# EAGLE board yoocnc_grbl (EAGLE 6.5.0)
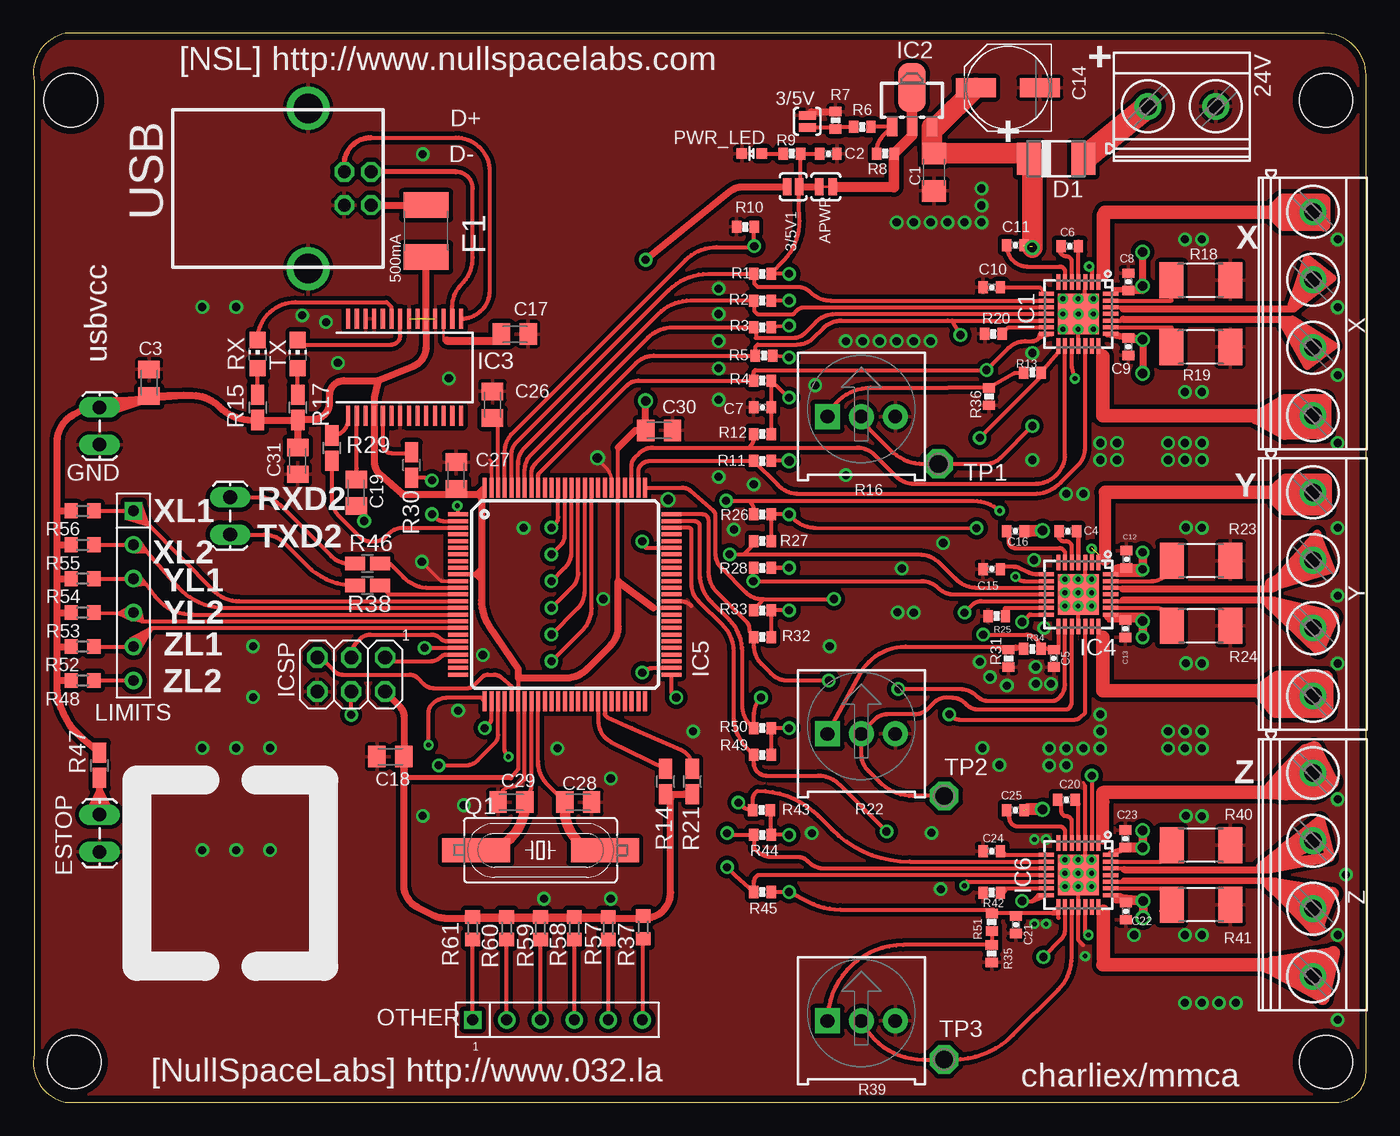
[diagram p6: board, top side]
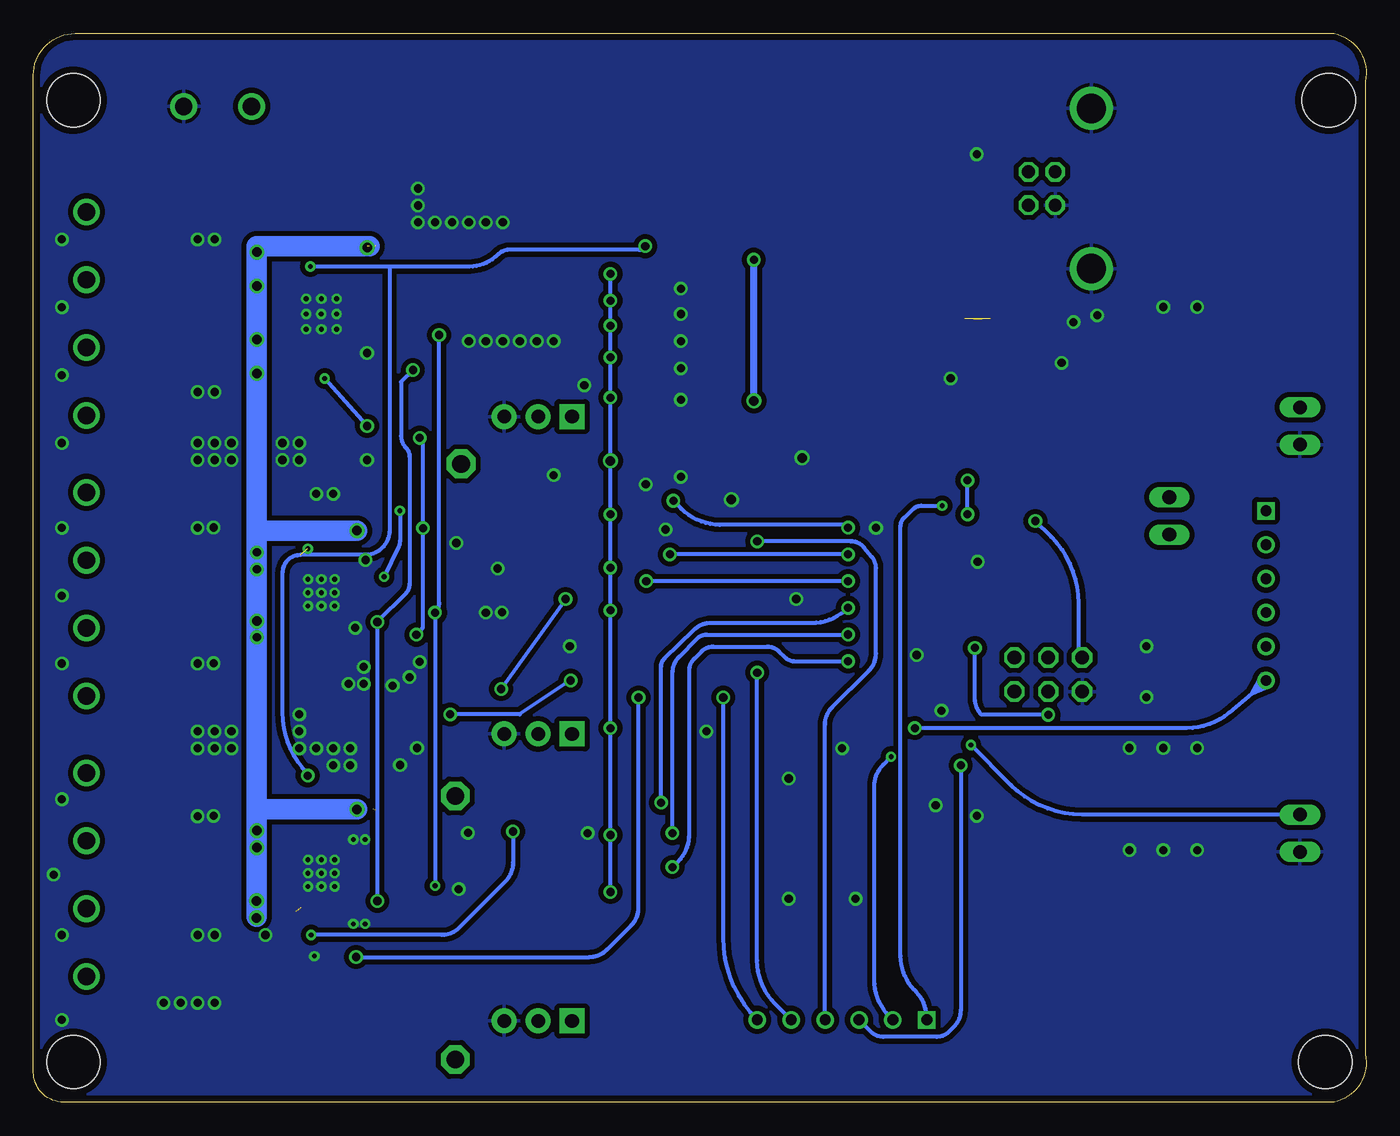
[diagram p7: board, bottom side, seen from below]

Size 99.8 x 80 mm. Coordinates in mm from the lower left corner, seen from the top.
Outline: 2.38,80 arc90 0.07,76.41 0.07,3.59 arc90 2.39,0 97.54,0 arc90 99.8,2.25 99.8,76.86 arc90 96.66,80 2.38,80
Copper layers (1*16): Top 0.0356mm / dielectric 1.5011mm / Bottom 0.0356mm
Design rules "SilverCircuits": minimum track width 7mil, minimum drill 14mil, track to track 7mil, track to pad 7mil, pad to pad 7mil, via to via 7mil, smd to smd 0mil, copper to edge 20mil, drill to drill 8mil, minimum pad ring 10mil, minimum via ring 8mil, stop-mask expansion 4mil, vias tented up to drill 0mil, thermal gap 10mil
Net classes: 0 default: width 0.305 mm, drill 0.305 mm, clearance 0.152 mm; 1 power: width 0.152 mm, drill 0.305 mm, clearance 0.152 mm; 2 gnd: width 0.152 mm, drill 0.305 mm, clearance 0.152 mm; 3 usbvcc: width 0.508 mm, drill 0.305 mm, clearance 0.152 mm
Holes 4 mm at 2.8,75 3.07,3 96.8,3 96.8,75

## Footprints (pad centres in the part's own frame; a part is rotated, then mirrored left to right if it is on the bottom)
SJ_2S-NO = smd 0.635 x 1.27: 1 -0.45,0; 2 0.45,0
MKDSN1,5/2-5,08 = drill 1.3 pad 2: 1 -2.561,0.025; 2 2.519,0.025
SJ_2S-TRACE = smd 0.635 x 1.27: 1 -0.508,0; 2 0.508,0
1206 = smd 1.6 x 1.8: 1 -1.4,0; 2 1.4,0
0402-CAP = smd 0.7 x 0.9: 1 -0.65,0; 2 0.65,0
C0805K = smd 1.3 x 1.6: 1 -1,0; 2 1,0
PANASONIC_D = smd 3 x 1.4: + 2.4,0; - -2.4,0
DO-214AC = smd 1.8 x 2.4: A 2.025,0; C -2.025,0
1X02_LOCK_LONGPADS = drill 1.016 long: 1 -0.127,0; 2 2.667,0
L1812 = smd 1.9 x 3.4: 1 -1.95,0; 2 1.95,0
QFN-28-5MM = smd 1.15 x 0.3: P$1 -2.4,1.5; P$2 -2.4,1; P$3 -2.4,0.5; P$4 -2.4,0; P$5 -2.4,-0.5; P$6 -2.4,-1; P$7 -2.4,-1.5; P$15 2.4,-1.5; P$16 2.4,-1; P$17 2.4,-0.5; P$18 2.4,0; P$19 2.4,0.5; P$20 2.4,1; P$21 2.4,1.5 | smd 0.3 x 1.15: P$8 -1.5,-2.4; P$9 -1,-2.4; P$10 -0.5,-2.4; P$11 0,-2.4; P$12 0.5,-2.4; P$13 1,-2.4; P$14 1.5,-2.4; P$22 1.5,2.4; P$23 1,2.4; P$24 0.5,2.4; P$25 0,2.4; P$26 -0.5,2.4; P$27 -1,2.4; P$28 -1.5,2.4 | smd 3.048 x 3.048: P$29 0,0
SCHMALZHAUS_SOT89 = smd 0.8 x 1.4: ADJ -1.499,-1.981; IN 1.499,-1.981; OUT 0,-1.98 | smd 2.032 x 3.65: OUT@1 0,0.94
SSOP28 = smd 0.381 x 1.499: 1 -4.225,-3.625; 2 -3.575,-3.625; 3 -2.925,-3.625; 4 -2.275,-3.625; 5 -1.625,-3.625; 6 -0.975,-3.625; 7 -0.325,-3.625; 8 0.325,-3.625; 9 0.975,-3.625; 10 1.625,-3.625; 11 2.275,-3.625; 12 2.925,-3.625; 13 3.575,-3.625; 14 4.225,-3.625; 15 4.225,3.625; 16 3.575,3.625; 17 2.925,3.625; 18 2.275,3.625; 19 1.625,3.625; 20 0.975,3.625; 21 0.325,3.625; 22 -0.325,3.625; 23 -0.975,3.625; 24 -1.625,3.625; 25 -2.275,3.625; 26 -2.925,3.625; 27 -3.575,3.625; 28 -4.225,3.625
TQFP100 = smd 1.5 x 0.3: 1 -8,6; 2 -8,5.5; 3 -8,5; 4 -8,4.5; 5 -8,4; 6 -8,3.5; 7 -8,3; 8 -8,2.5; 9 -8,2; 10 -8,1.5; 11 -8,1; 12 -8,0.5; 13 -8,0; 14 -8,-0.5; 15 -8,-1; 16 -8,-1.5; 17 -8,-2; 18 -8,-2.5; 19 -8,-3; 20 -8,-3.5; 21 -8,-4; 22 -8,-4.5; 23 -8,-5; 24 -8,-5.5; 25 -8,-6; 51 8,-6; 52 8,-5.5; 53 8,-5; 54 8,-4.5; 55 8,-4; 56 8,-3.5; 57 8,-3; 58 8,-2.5; 59 8,-2; 60 8,-1.5; 61 8,-1; 62 8,-0.5; 63 8,0; 64 8,0.5; 65 8,1; 66 8,1.5; 67 8,2; 68 8,2.5; 69 8,3; 70 8,3.5; 71 8,4; 72 8,4.5; 73 8,5; 74 8,5.5; 75 8,6 | smd 0.3 x 1.5: 26 -6,-8; 27 -5.5,-8; 28 -5,-8; 29 -4.5,-8; 30 -4,-8; 31 -3.5,-8; 32 -3,-8; 33 -2.5,-8; 34 -2,-8; 35 -1.5,-8; 36 -1,-8; 37 -0.5,-8; 38 0,-8; 39 0.5,-8; 40 1,-8; 41 1.5,-8; 42 2,-8; 43 2.5,-8; 44 3,-8; 45 3.5,-8; 46 4,-8; 47 4.5,-8; 48 5,-8; 49 5.5,-8; 50 6,-8; 76 6,8; 77 5.5,8; 78 5,8; 79 4.5,8; 80 4,8; 81 3.5,8; 82 3,8; 83 2.5,8; 84 2,8; 85 1.5,8; 86 1,8; 87 0.5,8; 88 0,8; 89 -0.5,8; 90 -1,8; 91 -1.5,8; 92 -2,8; 93 -2.5,8; 94 -3,8; 95 -3.5,8; 96 -4,8; 97 -4.5,8; 98 -5,8; 99 -5.5,8; 100 -6,8
2X03 = drill 1.016 octagon: 1 -2.54,-1.27; 2 -2.54,1.27; 3 0,-1.27; 4 0,1.27; 5 2.54,-1.27; 6 2.54,1.27
M1X6 = drill 0.8 square: 1 0,0 | drill 0.8: 2 2.54,0; 3 5.08,0; 4 7.62,0; 5 10.16,0; 6 12.7,0
LED-0603 = smd 0.8 x 0.8: A 0,-0.75; C 0,0.75
SM49 = smd 5.08 x 1.778: 1 -4.826,0; 2 4.826,0
0402-RES = smd 0.7 x 0.9: 1 -0.65,0; 2 0.65,0
R0805W = smd 1.5 x 1: 1 -0.94,0; 2 0.94,0
3386U = drill 1.016 pad 1.88 square: 1 -2.54,-0.015 | drill 1.016 pad 1.88: 2 0,-0.015; 3 2.54,-0.015
R2010 = smd 1.8 x 2.7: 1 -2.2,0; 2 2.2,0
R0603 = smd 1 x 1.1: 1 -0.85,0; 2 0.85,0
CHIP-LED0805 = smd 1.2 x 1.2: A 0,-1.05; C 0,1.05
P1-13 = drill 1.321 pad 2.159 octagon: TP 0,0
PN61729 = drill 0.95 octagon: 1 1.25,4.71; 2 -1.25,4.71; 3 -1.25,2.71; 4 1.25,2.71 | drill 2.2: P$1 -6,0; P$2 6,0
MKDSN1,5/4-5,08 = drill 1.3 pad 2: 1 -7.641,0.025; 2 -2.561,0.025; 3 2.519,0.025; 4 7.599,0.025

## Placement (x,y rotation side)
3/5V  SOLDERJUMPERNO  [SJ_2S-NO]  57.95,73.42 90 top
3/5V1  SOLDERJUMPERNO  [SJ_2S-NO]  56.9,68.52 0 top
24V  24vb  [MKDSN1,5/2-5,08]  86.02,74.51 0 top
APWR  SOLDERJUMPERTRACE  [SJ_2S-TRACE]  59.34,68.51 180 top
C1  .1uF  [1206]  67.44,69.61 270 top
C2  1uF  [0402-CAP]  59.53,71 0 top
C3  100n  [C0805K]  8.66,53.85 90 top
C4  .1uF  [0402-CAP]  77.47,42.74 180 top
C5  .1uf  [0402-CAP]  76.4,33.21 270 top
C6  .1uf  [0402-CAP]  77.6,64.07 180 top
C7  .1uf  [0402-CAP]  54.59,52 180 top
C8  .1uf  [0402-CAP]  81.99,61.4 90 top
C9  .1uf  [0402-CAP]  82,56.54 270 top
C10  .22uF  [0402-CAP]  71.76,60.99 180 top
C11  .1uf  [0402-CAP]  73.53,64.15 0 top
C12  .1uf  [0402-CAP]  81.86,40.64 90 top
C13  .1uf  [0402-CAP]  81.76,35.44 270 top
C14  47uF  [PANASONIC_D]  72.97,75.94 180 top
C15  .22uF  [0402-CAP]  71.76,39.9 180 top
C16  .1uf  [0402-CAP]  73.53,42.75 0 top
C17  100n  [C0805K]  36.05,57.49 180 top
C18  100n  [C0805K]  26.73,25.87 180 top
C19  100n  [C0805K]  24.18,45.62 270 top
C20  .1uf  [0402-CAP]  77.34,22.64 180 top
C21  .1uf  [0402-CAP]  73.57,13.27 270 top
C22  .1uf  [0402-CAP]  81.8,14.31 270 top
C23  .1uf  [0402-CAP]  81.76,19.71 90 top
C24  .22uF  [0402-CAP]  71.76,18.79 180 top
C25  .1uf  [0402-CAP]  73.53,21.86 0 top
C26  100n  [C0805K]  34.37,52.21 90 top
C27  100n  [C0805K]  31.66,46.91 90 top
C28  22p  [C0805K]  40.8,22.46 180 top
C29  22p  [C0805K]  35.8,22.46 0 top
C30  100n  [C0805K]  46.86,50.29 0 top
C31  100n  [C0805K]  19.8,48 270 top
D1  B340A-13-F  [DO-214AC]  76.58,70.62 0 top
ESTOP  [1X02_LOCK_LONGPADS]  4.95,18.86 90 top
F1  500mA  [L1812]  29.4,65.2 90 top
GND  [1X02_LOCK_LONGPADS]  4.95,51.88 270 top
IC1  A4983  [QFN-28-5MM]  78.26,59 270 top
IC2  LM317L  [SCHMALZHAUS_SOT89]  65.8,75 0 top
IC3  FT232RL  [SSOP28]  27.8,55 0 top
IC4  A4983  [QFN-28-5MM]  78.26,38 270 top
IC5  ATMEGA2560AU  [TQFP100]  39.8,38 0 top
IC6  A4983  [QFN-28-5MM]  78.26,17 270 top
ICSP  ICSP  [2X03]  23.8,32 180 top
LIMITS  CON_HEADER_1X06-PTH  [M1X6]  7.49,44.26 270 top
OTHER  CON_HEADER_1X06-PTH  [M1X6]  32.89,6.16 0 top
PWR_LED  YELLOW  [LED-0603]  53.8,71 90 top
Q1  16MHz  [SM49]  37.97,18.86 0 top
R1  20K  [0402-RES]  54.59,62 0 top
R2  20K  [0402-RES]  54.59,60 0 top
R3  20K  [0402-RES]  54.59,58 0 top
R4  20K  [0402-RES]  54.59,54 0 top
R5  20K  [0402-RES]  54.72,55.87 0 top
R6  390  [0402-RES]  62.07,73 0 top
R7  330  [0402-RES]  60.07,73.5 270 top
R8  240  [0402-RES]  63.8,71 0 top
R9  1K  [0402-RES]  56.8,71 0 top
R10  20K  [0402-RES]  53.32,65.53 180 top
R11  20K  [0402-RES]  54.59,48 0 top
R12  20K  [0402-RES]  54.59,50 0 top
R13  2.49K  [0402-RES]  74.8,54.61 180 top
R14  10k  [R0805W]  47.34,24 90 top
R15  1k  [R0805W]  16.8,52 270 top
R16  10K  [3386U]  62,51.32 0 top
R17  1k  [R0805W]  19.8,52 270 top
R18  .22  [R2010]  87.41,61.51 180 top
R19  .22  [R2010]  87.42,56.53 180 top
R20  20K  [0402-RES]  71.88,57.51 180 top
R21  10k  [R0805W]  49.34,24 90 top
R22  10K  [3386U]  62,27.58 0 top
R23  .22  [R2010]  87.44,40.52 180 top
R24  .22  [R2010]  87.44,35.65 180 top
R25  20K  [0402-RES]  72.14,36.38 180 top
R26  20K  [0402-RES]  54.59,44 0 top
R27  20K  [0402-RES]  54.59,42 0 top
R28  20K  [0402-RES]  54.59,40 0 top
R29  1K  [R0805W]  22.35,48.96 90 top
R30  1K  [R0805W]  28.32,47.69 90 top
R31  0K  [0402-RES]  73.03,33.21 270 top
R32  20K  [0402-RES]  54.59,34.81 0 top
R33  20K  [0402-RES]  54.59,36.81 0 top
R34  2.49K  [0402-RES]  74.8,33.93 180 top
R35  0K  [0402-RES]  71.76,11.12 270 top
R36  0K  [0402-RES]  71.57,52.81 270 top
R37  20K  [R0603]  45.66,13.08 270 top
R38  1K  [R0805W]  25.02,38.67 0 top
R39  10K  [3386U]  62,6.1 0 top
R40  .22  [R2010]  87.44,19.22 180 top
R41  .2  [R2010]  87.44,14.77 180 top
R42  20K  [0402-RES]  71.76,15.68 180 top
R43  20K  [0402-RES]  54.52,21.87 0 top
R44  20K  [0402-RES]  54.59,20 0 top
R45  20K  [0402-RES]  54.59,15.73 0 top
R46  1K  [R0805W]  25.02,40.33 0 top
R47  10k  [R0805W]  4.95,25.21 90 top
R48  20K  [R0603]  3.68,31.56 180 top
R49  20K  [0402-RES]  54.59,26 0 top
R50  20K  [0402-RES]  54.59,28 0 top
R51  2.49K  [0402-RES]  71.77,13.47 270 top
R52  20K  [R0603]  3.68,34.1 180 top
R53  20K  [R0603]  3.68,36.64 180 top
R54  20K  [R0603]  3.68,39.18 180 top
R55  20K  [R0603]  3.68,41.72 180 top
R56  20K  [R0603]  3.68,44.26 180 top
R57  20K  [R0603]  43.05,13.02 270 top
R58  20K  [R0603]  40.51,13.02 270 top
R59  20K  [R0603]  37.97,13.02 270 top
R60  20K  [R0603]  35.43,13.02 270 top
R61  20K  [R0603]  32.89,13.02 270 top
RS232  [1X02_LOCK_LONGPADS]  14.73,45.15 270 top
RX  [CHIP-LED0805]  16.8,56 0 top
TP1  TPPAD1-13  [P1-13]  67.77,47.78 90 top
TP2  TPPAD1-13  [P1-13]  68.2,22.92 0 top
TP3  TPPAD1-13  [P1-13]  68.2,3.19 0 top
TX  [CHIP-LED0805]  19.8,56 0 top
USB  [PN61729]  20.58,68.39 270 top
X  CONN  [MKDSN1,5/4-5,08]  95.8,59 270 top
Y  CONN  [MKDSN1,5/4-5,08]  95.8,38 270 top
Z  CONN  [MKDSN1,5/4-5,08]  95.8,17 270 top

## Tracks (layer width: path | path; a pad name or v marks a point on that pad's centre or on a via)
+3V3
  Top 0.203: IC3.17 30.72,57 30.98,57
  Top 0.61: 30.98,57 34.8,57 C17.2
+24V
  Top 0.8: 83.39,74.51 24V.1
  Top 1.778: D1.A 83.39,74.51
AREF
  Top 0.305: IC5.98 34.8,50.79 C26.1
CPOY  (via drill 0.36)
  Top 0.305: IC5.1 31.75,44.04 v31.75,44.64 | OTHER.1 R61.2
  Bottom 0.305: v31.75,44.64 33.32,44.64 arc-44 33.9,44.41 34.59,43.75 arc-46 34.85,43.13 34.85,10.95 arc-44 33.82,8.39 33.69,8.26 arc44 32.89,6.29 OTHER.1
D+
  Top 0.305: USB.3 23.29,70.21 | 25.27,72.2 31.62,72.2 arc-90 34.16,69.66 34.16,60.77 arc-90 IC3.15
  Top 0.356: 23.29,70.21 arc-90 25.27,72.2
D-
  Top 0.305: IC3.16 31.37,59.54 arc-45 32.06,61.21 arc45 32.89,63.22 32.89,68.39 arc90 31.64,69.64
  Top 0.356: 31.64,69.64 USB.2
DTR
  Top 0.305: 24.22,47.43 C19.1 24.18,46.79 24.22,46.84 | 24.22,46.84 IC3.2 | 24.22,46.84 arc90 24.26,46.8 24.26,46.29
ENABLE  (via drill 0.36, 0.61)  (1 unrouted)
  Top 0.305: IC5.97 35.3,48.67 arc-45 35.88,50.09 48.82,63.02 arc-45 51.18,64 53.85,64 | 53.85,64 53.91,64 | v79.25,24.45 v79.26,24.44 IC6.P$2 | v79.24,41.43 79.26,41.47 IC4.P$2 | IC1.P$2 79.26,62.42 v79.06,62.55 | R10.1 53.98,65.52 v53.98,64.07 53.85,64.02 53.85,64
  Bottom 0.305: v79.26,24.44 79.26,24.58 arc45 81.15,29.17 81.15,39.59 arc90 79.79,40.96 74.95,40.96 arc-45 73.68,41.48 arc-45 73.12,42.85 73.12,62.49 69.22,62.55 | 69.22,62.55 v79.06,62.55 | 69.22,62.55 67.14,62.55 arc-45 65.05,63.42 arc45 64.08,63.82 54.48,63.82 | 54.48,63.82 54.23,63.82 | v53.98,64.07 54.48,63.82
ESTOP_IN  (via drill 0.36)
  Top 0.305: IC5.26 33.5,30.29 31.05,30.29 arc45 29.86,29.8 arc45 29.59,29.15 v29.59,26.74
  Top 0.508: ESTOP.2 4.32,22.04 | 4.32,22.04 4.95,23.31 5.59,22.04 4.95,22.04 | 4.32,22.04 4.95,22.04 | 4.95,22.04 R47.1
  Bottom 0.305: ESTOP.2 21.28,21.53 arc45 26.58,23.73 v29.59,26.74
GND  (via drill 0.36, 0.61, 0.71)  (1 unrouted)
  Top 0.178: C29.1 arc-90 C29.1 | v79.23,17.14 79.23,17.59 78.76,17.59 | 78.76,17.5 78.76,17.59 | 78.76,17.59 78.61,17.59 | 34.3,47.94 arc90 34.16,48.07 | 3/5V.2 58.23,74.15
  Top 0.203: 78.76,23.67 78.61,23.94
  Top 0.254: IC5.11 30.64,39 arc-45 30.46,39.08 v29.08,40.45 | IC5.81 43.3,46.43 arc45 42.85,47.52 42.23,48.13 v42.23,48.22 | 78.76,38.82 78.61,38.67 IC4.P$29 | IC1.P$18 78.25,56.62 | 78.74,60.26 78.61,60.14 v78.23,60.14 | v79.38,60.14 79.25,60.14 78.61,59.5 | C29.1 34.8,22.54 arc-90 35.87,23.61 arc43 36.44,23.83 36.8,24.16 | IC5.99 34.3,47.94
  Top 0.305: 78.61,11.75 78.26,12.11 IC6.P$18 IC6.P$29 | 78.76,17.5 IC6.P$3 78.76,23.67 | IC5.62 48.44,37.5 arc-45 49.27,37.16 49.28,37.15 | 36.8,24.16 IC5.32 | 78.76,38.82 IC4.P$3 | IC4.P$18 IC4.P$29 | 78.74,60.26 IC1.P$3 | 78.25,56.62 v78.25,58.99
  Top 0.508: 58.23,74.15 R7.1
  other vias: 67.95,15.94 77.09,60.14 77.09,58.99 77.09,57.85 79.38,58.99 79.38,57.85 78.23,57.85 78.23,39.14 77.23,39.14 77.23,38.14 77.23,37.14 78.23,37.14 78.23,38.14 79.23,39.14 79.23,38.14 79.23,37.14 77.23,18.14 77.23,17.14 77.23,16.14 78.23,16.14 78.23,17.14 78.23,18.14 79.23,18.14 79.23,16.14 32.23,22.22 38.23,15.22 43.23,15.22 43.23,24.22 79.88,49.34 81.15,49.34 81.15,48.07 79.88,48.07 77.34,45.53 78.61,45.53 86.23,53.15 79.88,29.02 79.88,27.75 79.88,26.48 78.61,26.48 77.34,26.48 77.34,25.21 76.07,25.21 76.07,26.48 65.91,65.85 67.18,65.85 68.45,65.85 69.72,65.85 70.99,67.12 70.99,65.85 70.99,68.39 64.64,65.85 84.96,48.07 86.23,48.07 87.5,48.07 87.5,53.15 67.18,56.96 65.91,56.96 64.64,56.96 63.37,56.96 62.1,56.96 60.83,56.96 21.91,58.38 20.14,58.89 86.23,27.75 87.5,27.75 84.96,27.75 82.42,12.51 68.13,41.85 65.91,36.64 31.8,29.3 36.7,42.99 22.8,55.33 87.5,21.4 87.5,32.83 87.5,12.51 49.4,27.75 87.5,64.58 74.8,48.07 39.24,26.48 58.29,20.13 97.66,64.58 97.66,59.5 97.66,54.42 97.66,42.99 97.66,37.91 97.66,32.83 97.66,49.34 97.66,22.67 98.28,17.03 97.66,12.51 97.66,6.16 59.63,34.12 72.33,25.23 71.06,26.51 67.25,20.16 29.15,21.43 16.45,34.12 17.72,26.51 17.72,18.86 15.18,18.86 15.18,26.51 16.45,30.32 12.64,26.51 12.64,18.86 74.93,40.58 74.8,56.07 75.69,35.5 76.2,31.31 75.06,31.31 75.06,32.58 70.87,32.96 71.63,31.82 72.9,31.18 75.84,13.34 74.95,13.34 78.76,10.93 75.84,19.66 74.95,19.66 86.23,26.48 87.5,26.48 90.04,7.43 88.77,7.43 87.5,7.43 86.23,7.43 65.03,39.94 51.31,46.8 60.83,46.93 52.45,42.87 42.67,37.66 33.66,33.47 64.71,36.66 86.3,43.02 86.3,32.86 58.55,53.66 51.31,60.9 51.31,58.99 51.31,56.96 51.31,54.93 51.31,52.57 53.94,46.24 31.11,54.18 87.5,42.99 12.64,59.52 15.18,59.52 47.53,45.1 29.15,70.96 87.5,49.34 86.23,49.34 84.96,49.34 86.23,64.58 84.96,26.48 86.3,21.43 86.23,12.51
  pour Top (isolate 0.33): 99.8,80 0.07,80 0.07,0 99.8,0
  pour Bottom (isolate 0.381): 99.8,80 0.07,80 0.07,0 99.8,0
M8RXD
  Top 0.305: IC3.1 23.57,51.12 arc-90 R29.2
M8TXD
  Top 0.305: IC3.5 26.17,49.21 arc90 26.8,48.58 28.32,48.58 | 28.32,48.58 arc90 28.58,48.83 arc90 28.32,48.58 | 28.32,48.58 R30.2
N$1  (via drill 0.36)
  Top 0.305: v35.57,25.86 35.35,26.17 arc-36 35.3,26.33 IC5.29 | OTHER.2 R60.2
  Bottom 0.305: v35.57,25.86 36.15,25.27 arc-44 36.83,23.61 36.83,9.19 arc-45 35.68,6.41 OTHER.2
N$2
  Top 0.305: PWR_LED.A R9.1
N$3
  Top 0.305: R13.2 73.55,54.6 arc29 73.47,54.57 R36.1 68.53,53.48 62.68,53.48 arc68 R16.1
N$4
  Top 0.305: 3/5V.1 59.94,72.97 R7.2 60.22,73 R6.1
N$5  (via drill 0.61)
  Top 0.305: v30.35,25.21 32.37,25.21 arc45 33.27,25.58 34.53,26.85 arc45 34.8,27.49 IC5.28 | OTHER.3 R59.2
  Bottom 0.305: v30.35,25.21 30.35,6.91 arc45 30.88,5.64 31.25,5.26 arc45 32.15,4.89 36.18,4.89 arc45 37.08,5.26 OTHER.3
N$6
  Top 0.305: R8.1 63.15,71.14 arc-45 63.66,72.38 IC2.ADJ | IC2.ADJ 63.63,72.35 | R6.2 64.28,73 IC2.ADJ
N$7
  Top 0.305: R29.1 22.35,45.22 arc45 22.94,43.8 24.43,42.31 arc45 25.24,41.98 25.51,41.98 arc45 26.41,42.35 26.63,42.57 arc-45 27.68,43 IC5.3
N$8
  Top 0.305: IC1.P$4 78.26,64.43 arc90 C6.1
N$9
  Top 0.305: IC1.P$5 77.76,62.9 arc90 77.34,63.31 arc-90 76.87,63.79 C6.2
N$10  (via drill 0.61)
  Top 0.305: v29.85,44.01 30.13,43.72 arc45 30.67,43.5 IC5.2 | v29.85,46.55 29.63,46.64 arc24 29.12,46.75 R30.1
  Bottom 0.305: v29.85,44.01 v29.85,46.55
N$11
  Top 0.305: IC4.P$27 83.71,39 arc90 R23.2
N$12
  Top 0.305: IC4.P$23 84.14,37 arc-90 R24.2
N$13
  Top 0.305: 78.26,42.6 C4.1
  Top 0.33: IC4.P$4 78.26,42.6
N$14
  Top 0.305: IC4.P$5 77.76,41.56 arc90 77.34,41.98 arc-137 C4.2
N$15
  Top 0.305: IC4.P$13 72.75,37 R25.1
N$16
  Top 0.305: IC4.P$8 75.18,39.5 arc-27 74.47,39.67 73.85,39.98 arc27 73.45,40.07 72.57,40.07 C15.1
N$17
  Top 0.305: IC4.P$6 77.26,41.05 arc90 76.84,41.47 73.53,41.47 arc-90 73.03,41.98 73.03,42.74 72.9,42.76 C16.1
N$18  (via drill 0.61)
  Top 0.305: v45.59,41.98 45.82,41.5 IC5.70 | OTHER.4 R58.2
  Bottom 0.305: OTHER.4 40.51,28.28 arc45 39.99,29.55 37.23,32.31 arc-45 36.7,33.58 36.7,39.99 arc-40 37,40.8 37.59,41.51 arc-50 38.58,41.98 v45.59,41.98
N$19
  Top 0.305: IC1.P$13 73.03,58 R20.1
N$20
  Top 0.305: IC1.P$8 75.37,60.99 C10.1
N$21
  Top 0.305: IC1.P$6 77.26,62.13 arc90 76.84,62.55 74.41,62.55 arc-90 C11.1
N$22
  Top 0.305: R22.1 61.94,32.1 arc-61 65.31,34.1 73.53,34.1 | 73.53,34.1 73.79,34.1 73.62,33.93 | R34.2 73.62,33.93 | 72.43,33.93 73.53,33.93 73.62,33.93 | R31.1 73.53,34.1
N$23  (via drill 0.61)
  Top 0.305: v45.59,32.15 arc-46 46.41,32.5 IC5.52 | OTHER.5 R57.2
  Bottom 0.305: OTHER.5 44.25,7.36 arc45 45.59,10.6 v45.59,32.15
N$24
  Top 0.305: IC5.13 26.63,38 R38.2
N$25
  Top 0.305: IC5.12 29.61,38.5 arc-45 27.71,39.29 26.67,40.33 R46.2
N$26
  Top 0.305: IC6.P$27 84.46,18 84.46,19.37 85.24,19.37 R40.2
N$27
  Top 0.305: IC6.P$23 84.46,16 84.46,14.29 85.28,14.29 R41.2
N$28
  Top 0.305: IC6.P$4 78.26,22.3 C20.1
N$29
  Top 0.305: IC6.P$5 77.76,20.99 arc90 77.34,21.4 77.27,21.4 arc-45 77.18,21.44 77.1,21.52 arc-45 76.96,21.85 76.96,22.31 C20.2
N$30
  Top 0.305: IC6.P$13 72.78,16 72.78,15.8 R42.1
N$31
  Top 0.305: IC1.P$27 85.21,60 R18.2
N$32
  Top 0.305: IC1.P$23 85.22,58 85.22,56.71 85.2,56.71 R19.2
N$33
  Top 0.305: IC6.P$8 72.73,18.5 arc90 72.44,18.79 C24.1
N$34
  Top 0.305: IC6.P$6 77.26,20.22 arc90 76.84,20.64 73.72,20.64 arc-90 73.08,21.29 C25.1
N$36
  Top 0.305: R51.2 71.77,11.77 R35.1 65.14,11.77 arc90 R39.1
N$52
  Top 0.305: RX.C arc-90 19.63,59.88 26.44,59.88 26.82,59.5 IC3.23
N$53
  Top 0.305: IC3.22 27.47,57.38 arc-90 26.8,56.71 20.14,56.71 arc-90 TX.C
N$54
  Top 0.305: R15.1 RX.A
N$55
  Top 0.305: R17.1 TX.A
N$56
  Top 0.305: IC5.34 37.8,25.49 arc45 38.52,23.73 C28.2 39.8,21.78
  Top 0.762: 39.8,21.78 arc90 42.86,18.71
N$57
  Top 0.305: IC5.33 37.3,23.65 arc-26 37.22,23.31 C29.2 36.8,22.3
  Top 0.762: 36.8,22.3 arc-90 33.21,18.71
N$60
  Top 0.508: USB.1 F1.2 arc90 F1.2
PB1
  Top 0.305: ICSP.3 23.8,33.39 arc-45 24.23,34.43 24.5,34.7 arc-45 25.22,35 29.8,35 arc-45 30.45,34.73 arc45 31.01,34.5 IC5.20
PB2  (via drill 0.61)
  Top 0.305: v23.8,29 ICSP.4 | v29.3,34 IC5.21
  Bottom 0.305: v23.8,29 28.8,29 arc45 29.3,30.21 v29.3,34
PB3
  Top 0.305: IC5.22 30.93,33.5 arc45 30.5,33.32 arc-45 29.72,33 26.3,33 26.57,33.5 ICSP.1
RESET  (via drill 0.61)
  Top 0.305: ICSP.5 21.34,33.27 arc-45 21.66,33.14 22.55,32.24 arc45 23.14,32 28.18,32 arc-45 28.77,31.76 29.23,31.29 arc45 29.94,31 32.56,31 arc45 32.96,31.17 33.63,31.83 arc-45 34.03,32 34.51,32 arc-41 35.01,31.81 35.8,31.13 IC5.30 | v24.77,43.5 24.77,44.03 C19.2
  Bottom 0.305: v24.77,43.5 23.58,42.31 arc45 21.53,37.36 21.53,33.27 ICSP.5
RXD2
  Top 0.305: RS232.1 16.96,45.28 arc-45 18.58,44.6 22.33,40.85 arc45 23.61,40.33 R46.1
S_RESET  (via drill 0.36, 0.61)
  Top 0.305: IC5.93 37.3,47.1 arc-45 37.58,47.79 45.12,55.32 arc-45 46.45,55.87 R5.1 54.07,56.54 54.23,56.71 57.18,56.71 arc45 58.43,57.23 59.15,57.94 arc-45 60.5,58.5 68.45,58.5 | 68.45,58.5 IC1.P$12 | IC6.P$12 69.9,16.5 v69.72,16.2 | v69.72,36.64 70.3,37.22 arc-45 70.98,37.5 IC4.P$12 | v69.42,57.43 68.8,58.51 68.45,58.5
  Bottom 0.305: v69.72,16.2 v69.72,36.64 69.7,36.67 arc-45 69.4,37.38 69.4,57.15 v69.42,57.43 69.42,57.41
SCL
  Top 0.305: IC5.43 42.3,28.53 arc64 43.27,26.96 R14.2
SDA
  Top 0.305: IC5.44 42.8,29.08 arc66 42.97,28.81 44.8,28 48.48,26.38 arc-66 49.34,25.06 R21.2
SLEEP  (via drill 0.61)
  Top 0.305: IC5.92 37.8,46.89 arc-45 37.87,47.08 44.46,53.66 arc-45 45.28,54 R4.1 53.94,54.6 arc-77 54.1,54.8 v71.38,54.8 73.01,56.44 arc-45 74.28,56.96 74.84,56.96 arc86 75.35,57.44 75.36,57.47 76.24,57.47 75.39,57.49 75.98,57.44 75.39,57.25 75.96,57.45 75.41,57.5 IC1.P$14 | IC6.P$14 74.8,15.05 75.25,15.5 74.8,15.05 v74.04,15.05 | v74.04,35.94 74.53,36.43 arc-45 74.7,36.5 IC4.P$14
  Bottom 0.305: v74.04,15.05 v74.04,35.94 71.93,38.05 arc-45 71.63,38.79 71.63,48.34 arc-45 71.89,48.97 arc45 72.26,49.87 72.26,53.91 v71.38,54.8
TOUCH_SENSOR  (via drill 0.61)
  Top 0.305: IC5.51 47.8,30.63 v48.13,30.29 | OTHER.6 arc45 45.66,6.32 R37.2
  Bottom 0.305: OTHER.6 arc45 48.13,12.29 v48.13,30.29
TXD2
  Top 0.305: RS232.2 17.29,42.48 arc-45 18.78,41.87 20.48,40.16 arc45 R38.1
USBVCC  (via drill 0.61, 0.71)  (1 unrouted)
  Top 0.305: 46.43,37 IC5.61 | 36.3,31.75 IC5.31 36.3,24.93 35.77,24.27 | 33.77,45.44 IC5.100 | 43.8,49 IC5.80 43.8,39
  Top 0.33: 33.17,39.5 IC5.10 | 33.67,45.86 33.77,45.44
  Top 0.356: 35.77,24.27 27.8,24.27
  Top 0.508: 25.8,54 28.41,55.06 arc68 29.43,56.58 IC3.19 29.42,63.23 arc90 F1.1 | 25.8,54 25.52,52.73 IC3.4 25.52,47.93 arc49 25.94,47 27.65,45.5 | 27.65,45.5 33.3,45.5 | ICSP.2 27.42,29.64 arc-45 27.8,28.74 27.8,24.27 C18.1 27.73,16.23 arc63 28.7,14.63 29.97,13.98 arc27 30.79,13.78 32.81,13.78 | 46.43,37 43.8,39 43.8,35.6 arc-45 43.2,34.17 41.48,32.44 arc-45 39.81,31.75 36.3,31.75 36.3,32.43 34.14,35.64 arc-34 33.55,37.57 33.55,39.12 | 33.55,39.88 33.17,39.5 33.55,39.12 | 33.3,45.5 33.55,45.25 33.55,39.12 | 33.3,45.5 33.67,45.86 | R17.2 C31.1 | R17.2 R15.2 16.35,51.06 arc-45 13.91,52.07 arc45 11.91,52.9 11.26,52.9 | C27.1 31.72,45.51 27.65,45.5 | 48.74,23.06 R21.1 R14.1 47.71,22.68 47.71,15.69 arc-90 45.81,13.78 | v45.85,63.06 52.16,68.18 arc-39 53.12,68.52 3/5V1.1 | 6.22,52.52 6.73,52.26 5.46,52.52 GND.1 3.81,52.01 4.95,51.88 | 6.22,52.52 5.59,52.52 6.22,51.88 8.13,52.52 6.22,52.52 | 6.22,52.52 11.26,52.9 | R17.2 arc-90 19.86,51.12 20.96,51.12 arc90 22.18,52.35 22.18,52.92 arc-90 23.26,54 25.8,54 | 11.26,52.9 C3.1 | 32.81,13.78 45.81,13.78 | 45.81,13.78 R37.1 | R47.2 3.64,27.25 arc-50 1.78,31.25 1.78,31.56 | 1.78,31.56 1.78,34.1 | 1.78,34.1 1.78,36.64 | 1.78,36.64 1.78,39.18 | 1.78,39.18 1.78,41.72 | 1.78,41.72 1.78,44.26 | 1.78,44.26 1.78,49.4 arc-59 2.93,51.43 3.68,51.88 4.32,52.52 | 4.95,51.88 4.73,51.79 arc-165 4.32,52.52 | 4.32,51.88 4.32,52.52 | 4.32,52.52 4.95,51.88 | 1.78,44.26 R56.2 | 1.78,41.72 R55.2 | 1.78,39.18 R54.2 | 1.78,36.64 R53.2 | 1.78,34.1 R52.2 | 1.78,31.56 R48.2 | 32.81,13.78 R61.1 R60.1 R59.1 R58.1 R57.1 | 43.8,49 45.09,50.29 C30.1 45.85,50.3 v45.85,52.49
  Bottom 0.508: v45.85,52.49 v45.85,63.06
V+  (via drill 0.61, 0.71)  (3 unrouted)
  Top 0.178: v83.09,15.06 83.1,14.99 83.1,15.13 83.06,15.13 83.06,15.31 82.42,15.31 82.42,15.05 | 81.05,15.27 81.8,15.12 81.8,15.2 81.92,15.2 C22.1 | 74.63,42.74 C16.2 | 80.95,60.79 IC1.P$28 | IC1.P$22 80.42,57.43 | C23.1 81.73,19.06 | IC6.P$28 80.66,18.72 80.66,18.63 | 74.18,64.07 74.8,64.07 | 81.16,39.88 C12.1 81.75,39.99 83.07,39.61 | IC4.P$22 80.72,36.5 80.51,36.34 80.51,36.01 v83.06,36.01 | 83.02,36.34 83.24,36.27 | 83.24,36.27 81.96,36.27 C13.1 | 83.24,36.27 83.11,36.27 83.11,36.18 | v83.09,13.79 83.1,13.79 | 83.06,19.18 83.19,19.05 | 83.06,60.75 83.06,63.31
  Top 0.203: 83.05,19.06 v83.06,19.05 83.19,19.05 | 81.08,39.61 IC4.P$28
  Top 0.254: C1.1 67.3,71.15 | C9.1 81.21,57.52 | v83.06,57.09 83.01,57.12 | C8.1 81.89,60.79 | D1.C 74.75,71.01
  Top 0.305: IC6.P$22 81.27,15.5 arc-90 C22.1
  Top 0.406: 81.89,60.79 80.95,60.79 | 80.42,57.43 C9.1
  Top 0.432: 80.66,18.63 81.94,19.06
  Top 0.508: 83.06,60.75 C8.1 | v83.06,61.09 83.06,63.31 v83.06,63.63 | v83.06,57.09 v83.06,54.55 | 81.08,39.61 83.07,39.61
  Top 0.635: 83.01,57.12 C9.1 | 80.51,36.34 83.02,36.34 | 83.1,13.79 83.1,14.99 | v83.06,20.32 83.06,19.18 | v83.06,36.01 v83.06,34.8 | v83.06,39.88 v83.06,41.15
  Top 0.762: IC2.IN 67.61,73.02 | 83.05,19.06 81.94,19.06 C23.1 | 81.05,15.27 v83.09,15.06 | v74.8,63.96 74.18,64.07 | 74.81,70.99 D1.C | v83.06,39.88 81.16,39.88
  Top 0.889: v75.57,21.91 74.38,21.91 | v75.57,42.78 74.63,42.74
  Top 1.524: 67.3,71.15 IC2.IN | 67.61,73.02 C14.+ | v74.8,63.96 74.8,64.07 74.8,66.11 74.81,70.99 | 74.75,71.01 C1.1
  Bottom 0.178: 83.06,13.89 82.43,15.31 82.43,15.07 82.42,15.07 82.42,15.05 v83.09,15.05 v83.09,15.06 | v74.8,63.96
  Bottom 0.254: v83.06,61.09 83.06,61.84
  Bottom 1.524: 83.06,13.89 v83.06,19.05 83.06,21.91 | 83.06,21.91 v75.57,21.91 | 83.06,42.78 v83.06,39.88 v83.06,36.01 83.06,21.91 | 83.06,42.78 v75.57,42.78 | v83.06,61.09 v83.06,57.09 83.06,42.78 | 74.6,64.07 83.06,64.07 83.06,61.84 83.06,61.22
VCC  (via drill 0.61, 0.71)
  Top 0.305: v56.59,62 R1.2 56.25,63.06 arc45 57.37,65.94 57.34,67.38 3/5V1.2 | v56.59,60 R2.2 | v56.59,58.13 R3.2 | v56.59,55.75 R5.2 | v56.59,52.73 R4.2 C7.1 R12.2 | v56.59,36.81 R33.2 R32.2 | v56.59,48 R11.2 | R49.2 R50.2 v56.59,28 56.78,28 | v56.59,20 R44.2 55.24,21.8 R43.2 | R45.2 v56.59,15.73 58.05,14.99 arc27 60.43,14.42 71.77,14.42 | R27.2 R26.2 v56.59,44 56.91,43.68 arc45 58.56,42.99 v70.62,42.96 | C2.1 R9.2 57.45,68.65 | 76.76,13.78 IC6.P$15 76.73,14.14 76.74,14.34 76.69,14.13 76.72,14.64 76.31,14.13 76.67,14.12 73.57,14.12 | 57.45,68.65 57.28,68.65 | 3/5V1.2 57.34,68.58 | 75.33,34.05 R34.1 76.76,33.93 IC4.P$15 | 75.33,34.05 C5.1 | IC1.P$15 76.76,56.13 R13.1 75.45,54.31 v70.87,49.72 | 3/5V1.2 | 3/5V1.2 | 3/5V1.2 57.35,68.27 3/5V1.2 | 3/5V1.2 57.53,68.52 57.45,68.65 | v71.12,34.99 74.38,34.99 arc-90 75.33,34.05 | C21.1 73.57,14.12 | 73.57,14.12 R51.1 71.77,14.42 | 71.77,14.42 71.88,14.42
  Top 0.33: v56.59,40 R28.2
  Top 0.508: 3/5V1.2 APWR.2
  Bottom 0.305: v56.59,62 v56.59,60 v56.59,58.13 v56.59,55.75 v56.59,52.73 v56.59,48 v56.59,44 v56.59,40 v56.59,36.81 v56.59,28 v56.59,20 v56.59,15.73 | v71.12,34.99 70.74,35.38 arc-45 70.62,35.65 v70.62,42.96 70.62,49.32 arc-45 70.74,49.6 v70.87,49.72
X_5V_ALT
  Top 0.508: 59.97,68.49 60.71,68.51 APWR.1
  Top 0.762: 64.45,68.49 59.97,68.49
  Top 0.8: IC2.OUT@1 IC2.OUT 65.8,72.35 R8.2 64.45,68.49
X_COILA+
  Top 0.254: 80.07,55.82 80.07,56.28 79.95,56.29 79.88,55.69 IC1.P$21
  Top 1.016: 93.27,51.37 80.07,51.37 80.07,55.82 | 95.89,51.37 95.32,51.4 93.29,51.4 93.66,51.76 95.97,51.76 96.08,51.66 96.08,50.78 95.83,50.58 93.61,50.58 93.27,51.37 | 93.27,51.37 95.89,51.37 | 95.89,51.37 96.01,51.37 96.72,50.13 93.71,50.08 91.59,51.21 93.65,52.47 93.7,52.51 96.7,52.54 96.71,50.37 95.86,51.4 X.4
X_COILA-
  Top 0.254: 81.49,58.5 arc90 81.6,58.61
  Top 0.305: IC1.P$24 81.49,58.5
  Top 0.508: 81.6,58.61 94.3,58.61 94.33,58.54
  Top 0.635: 94.33,58.54 97.37,56.61 95.4,55.11 93.67,58.19 94.19,58.19 95.65,56.73 95.01,56.73 94.7,57.04 94.7,57.34 94.5,57.54 95.19,57.54 95.32,57.67 95.32,57.54 95.76,57.09 X.3
X_COILB+
  Top 0.178: 80.25,66.61 80.14,66.5 80.14,66.38
  Top 0.254: IC1.P$1 79.76,61.72 80.14,61.97
  Top 1.016: 80.25,66.61 92.71,66.61 | 92.71,66.61 93.6,65.72 96.63,65.67 96.63,67.49 92.71,66.61 | 92.71,66.61 93.6,67.5 96.52,67.52 95.76,66.61 | 96.63,65.67 95.76,66.61 | 92.84,66.61 95.76,66.61 | 95.76,66.61 95.76,66.64 X.1 | 80.14,61.97 80.14,66.38
X_COILB-
  Top 0.178: 94.39,59.45 94.39,59.41 94.42,59.38
  Top 0.254: 81.54,59.5 arc-90 81.59,59.39
  Top 0.305: IC1.P$26 81.54,59.5
  Top 0.508: 81.59,59.39 94.42,59.38
  Top 0.635: 94.39,59.45 95.38,60.77 94.74,61.03 95.76,61.53 95.12,60.77 95.25,60.9 97.21,61.66 | 97.21,61.66 94.36,59.5 95.38,63.11 94.25,59.63 95.49,63.06 97.27,61.67 94.4,59.46 97.21,61.66 | 97.21,61.66 X.2
X_CUR_REF  (via drill 0.36, 0.61)
  Top 0.305: v77.98,54.17 77.79,54.89 arc-15 77.76,55.16 IC1.P$17 | v74.8,50.61 72.44,48.24 arc-45 71.31,47.78 TP1.TP 66.64,47.78 arc-45 64.19,48.79 62.62,50.37 R16.2
  Bottom 0.305: v74.8,50.61 v77.98,54.17
X_DIR
  Top 0.305: IC5.77 45.3,47.19 arc-45 45.52,47.72 arc-45 46.19,48 R11.1 55.74,46.2 arc45 57.35,45.53 74.9,45.53 arc45 76.91,46.36 78.23,47.68 arc45 78.76,48.96 IC1.P$19
X_MS1
  Top 0.305: IC5.96 35.8,48.46 arc-45 36.18,49.38 47.56,60.77 arc-45 50.54,62 R1.1 53.98,61.96 53.98,61.28 54.23,61.03 57.24,61.03 arc-45 58.18,60.64 arc45 59.71,60 IC1.P$9
X_MS2
  Top 0.305: IC5.95 36.3,47.78 arc-45 36.8,49.01 46.8,59 arc-45 49.23,60.01 53.95,60.01 | 53.95,60.01 53.98,60.01 | IC1.P$10 57.77,59.5 arc45 57.14,59.24 56.9,58.99 54.23,58.99 53.98,59.25 53.98,59.96 R2.1 53.95,60.01
X_MS3
  Top 0.305: IC5.94 36.8,47.3 arc-45 37.29,48.49 46.02,57.22 arc-45 47.9,58 R3.1 54.1,57.84 54.1,57.22 56.96,57.22 arc45 57.72,57.53 58.58,58.39 arc-45 60.05,59 IC1.P$11
X_STEP
  Top 0.305: 53.59,49 53.73,49.14 arc45 53.94,49.65 R12.1 | IC5.78 44.8,47.67 arc-45 45.03,48.24 45.38,48.59 arc-45 46.38,49 53.59,49 | 53.59,49 61.68,49 arc-45 62.99,48.46 64.59,46.86 arc45 65.95,46.29 75.07,46.29 arc45 76.57,46.91 76.64,46.99 arc45 77.26,48.47 IC1.P$16
XL1
  Top 0.305: IC5.14 15.39,37.5 arc-46 13.46,38.31 8.63,43.23 7.99,43.57 7.55,43.79 7.92,44.33 8.64,43.2 7.01,43.7 8.03,44.77 8.59,43.18 LIMITS.1 R56.1
XL2
  Top 0.305: IC5.15 14.33,37 arc-48 10.81,38.58 8.44,41.25 7.83,41.67 7.46,41.21 8.49,41.19 7.88,42.05 7.29,41.3 LIMITS.2 R55.1
Y_COILA+
  Top 0.254: 80.07,34.8 IC4.P$21 | Y.4 95.84,30.8
  Top 1.016: 80.07,34.8 80.07,30.8 91.79,30.8 | 91.79,30.8 93.37,30.01 93.45,30.09 95.99,30.09 95.93,30.04 95.85,30.04 95.82,30.01 95.07,30.01 95.04,30.04 93.96,30.04 93.48,30.52 93.15,30.52 93.43,30.8 95.84,30.8 93.6,30.93 96.84,31.54 96.84,29.25 93.01,29.27 92.88,29.39 91.79,30.8 | 91.79,30.8 93.15,31.75 93.19,31.79 96.8,31.79 96.7,31.68 96.7,31.58
Y_COILA-
  Top 0.178: 81.6,37.59 81.5,37.59 81.5,37.5
  Top 0.254: 93.85,36.45 93.85,36.39
  Top 0.305: IC4.P$24 81.5,37.5
  Top 0.508: 81.6,37.59 92.71,37.59 arc-90 93.85,36.45 | 93.85,36.39 arc90 92.95,37.29
  Top 1.016: 92.95,37.29 97.26,36.29 96.2,33.98 92.66,37.36 Y.3
Y_COILB+
  Top 0.178: 80.07,41.72 80.26,40.58 IC4.P$1
  Top 0.914: 80.26,40.58 80.26,45.66
  Top 1.016: 80.26,45.66 93.09,45.66 93.09,45.91 93.77,46.55 96.74,46.55 | 96.74,46.55 96.74,44.41 93.69,44.43 93.23,44.89 95.12,45.53 94.89,45.3 93.56,45.3 93.77,45.09 94.91,45.09 94.27,45.73 94.14,45.73 94.22,45.8 95.38,45.8 95.86,45.32 96.21,45.32 96.74,46.55 | 96.74,46.55 Y.1
Y_COILB-
  Top 0.203: 81.41,38.5 arc-90 81.58,38.41
  Top 0.254: 92.71,38.41 93.15,38.89
  Top 0.305: IC4.P$26 81.41,38.5
  Top 0.508: 81.58,38.41 92.71,38.41 | 96.68,40.29 95.95,40.45 | 92.75,38.51 97.24,39.84 96.13,42.54 | 95.47,40.06 Y.2 | 94.98,40.56 arc90 94.46,40.2 arc-90 93.15,38.89
  Top 0.635: 96.02,41.57 92.75,38.51 | 96.13,42.54 92.76,38.73
  Top 1.016: 94.98,40.56 96.68,40.29
  Top 1.143: 95.95,40.45 96.02,41.57 | 92.76,38.73 95.47,40.06
Y_CUR_REF
  Top 0.305: TP2.TP 65.89,22.92 arc-45 63.34,23.98 62.53,24.79 arc-45 62,26.06 R22.2 62,27.59 arc-45 62.04,27.69 63,28.65 arc-45 63.9,29.02 65.96,29.02 arc45 66.97,29.44 67.4,29.88 arc-45 68.41,30.29 68.7,30.29 arc-45 69.8,29.84 69.89,29.75 arc45 70.72,29.4 77.37,29.4 arc45 77.54,29.47 arc45 77.76,29.99 IC4.P$17
Y_DIR  (via drill 0.61)
  Top 0.305: v59.56,31.56 56.5,31.56 arc-45 55.23,32.09 54.51,32.8 arc-45 53.94,34.19 R32.1 53.86,34.88 arc-45 53.6,35.53 arc45 53.44,35.91 51.18,38.17 arc-45 50.55,39.7 50.55,43.6 arc45 50.44,43.87 arc45 50.11,44 IC5.75 | IC4.P$19 78.76,29.16 78.39,28.8 arc-45 78.01,28.64 69.32,28.64 arc-45 68.71,28.89 v68.58,29.02
  Bottom 0.305: v59.56,31.56 63.37,29.02 v68.58,29.02
Y_MS1  (via drill 0.36, 0.61)
  Top 0.305: v51.87,45.02 51.86,45 53.59,45 | 53.59,45 70.42,45 arc-41 v72.35,44.27 | v38.8,43 39.07,43.28 arc45 39.3,43.82 IC5.89 | 53.59,45 53.7,44.89 arc-45 53.94,44.31 R26.1 | v73.53,39.32 arc52 74.2,39 IC4.P$9
  Bottom 0.305: v72.35,44.27 72.35,42 arc26 72.47,41.48 v73.53,39.32 | v51.87,45.02 51.27,44.41 arc-45 48.39,43.22 39.02,43.22 v38.8,43
Y_MS2  (via drill 0.61)
  Top 0.305: v52.13,41 53.21,41 | v38.8,41 39.46,41.67 arc45 39.8,42.47 IC5.88 | IC4.P$10 70.69,38.5 arc-45 69.04,39.18 67.88,40.34 arc45 66.3,41 53.21,41 | R27.1 53.94,41.72 53.21,41
  Bottom 0.305: v38.8,41 v52.13,41
Y_MS3  (via drill 0.61)
  Top 0.305: R28.1 53.94,39.35 53.59,39 v53.91,39 66.53,39 arc-45 67.74,38.5 arc45 68.94,38 IC4.P$11 | v38.8,39 39.82,40.03 arc45 40.3,41.17 IC5.87
  Bottom 0.305: v38.8,39 v53.91,39
Y_STEP  (via drill 0.61)
  Top 0.305: 53.9,36.77 R33.1 54.66,37.66 | IC4.P$16 77.26,31.32 arc-45 76.83,30.29 76.75,30.2 arc-45 76.35,30.04 71.53,30.04 arc-45 70.62,30.42 arc45 69.38,30.93 v64.77,30.93 | 54.66,37.66 v59.95,37.66 | 54.66,37.66 54.53,37.66 arc-45 53.37,38.14 51.51,40 arc-45 51.06,41.09 51.06,43.95 arc49 50.92,44.26 49.2,45.77 arc41 48.59,46 IC5.76
  Bottom 0.305: v59.95,37.66 v64.77,30.93
YL1
  Top 0.305: IC5.16 11.93,36.5 arc-52 9.1,37.88 8.39,38.79 8.14,38.86 7.99,39.28 7.44,38.66 8.42,38.76 7.78,39.59 7.44,38.69 LIMITS.3 R54.1
YL2
  Top 0.305: IC5.17 8.14,36 7.8,36.29 7.44,36.16 8.14,35.99 7.93,36.94 7.69,36.37 7.41,36.13 7.4,36.54 LIMITS.4 7.48,37.15 6.43,36.59 7.67,36.4 7.03,36.66 7.47,37.14 7.35,36.14 6.4,36.59 R53.1
Z_COILA+  (1 unrouted)
  Top 0.178: 97.14,10.88 97.16,10.88 97.35,11.18
  Top 0.203: 79.76,10.1 80.08,10.29 80.13,10.73
  Top 0.254: 92.84,9.79 92.84,10.29
  Top 0.762: Z.4 95.63,9.4 95.63,8.7 91.95,10.16 95.89,9.4 | 97.35,11.18 96.55,7.78 92.84,9.79 91.57,10.29 | 97.06,11.05 96.67,10.96 97.14,10.88 96.93,10.88
  Top 1.016: 80.08,10.29 92.84,10.29 | 80.13,10.73 80.13,14.29 | 97.35,11.18 96.56,7.78
  Top 1.143: 96.93,10.88 95.89,9.4
  Top 1.27: 92.84,10.29 97.08,10.96
Z_COILA-
  Top 0.178: 92.41,16.5 92.41,16.37 92.64,16.34
  Top 0.305: 93.02,16.58 92.41,16.5 | 81.66,16.58 81.71,16.5 IC6.P$24
  Top 0.483: 81.66,16.58 93.02,16.58
  Top 0.762: 97.29,15.58 95.76,14.03 94.74,15.31 94.55,14.61 arc-90 96.24,13.1 97.3,15.74 93.99,15.25 97.29,15.58 | 97.29,15.58 94.9,15.66 92.46,16.39 95.97,12.76 97.24,15.61 | 97.29,15.58 Z.3
  Top 1.016: 97.24,15.61 92.64,16.34 96.24,13.1
Z_COILB+
  Top 0.178: 80.2,23.18 80.29,23.18 80.31,23.16 80.31,22.91 80.09,22.45
  Top 0.203: 80.09,19.76 79.88,20.45 79.76,20.58
  Top 0.254: IC6.P$1 79.76,20.58 | 96.54,24.41 Z.1
  Top 0.762: 93.83,23.25 94.22,23.18 96.54,24.41
  Top 0.965: 80.09,19.76 80.09,22.45 80.07,23.18
  Top 1.016: 80.2,23.18 94.22,23.18 | 95.9,26.44 97.2,23.98
  Top 1.143: 93.83,23.25 92.57,23.25 92.56,23.26 93.85,24.78 95.29,26.22 95.9,26.44 | 97.2,23.98 96.23,23.29 95.69,23.83 95.69,24.8 95.63,25.28 95.42,24.94 94.61,24.13 94.5,24.13 95.36,23.26 96.01,23.26 95.91,23.16 93.31,23.18 93.37,23.24 94.12,23.24 94.12,23.62 93.78,23.28 93.78,23.16
Z_COILB-
  Top 0.178: 92.55,17.62 93.8,17.89 96.32,20.49 | 91.92,17.62 92.55,17.62 | 92.55,17.62 92.58,17.59 92.58,17.51 92.56,17.49 | 92.65,17.47 92.58,17.4
  Top 0.305: 92.65,17.47 92.56,17.49 92.27,17.56 | 81.69,17.4 81.88,17.5 IC6.P$26
  Top 0.508: 81.69,17.4 92.58,17.4 97.17,18.26
  Top 0.762: 93.35,18.1 arc-90 94.81,19.56 91.92,17.62 96.34,21.08 96.76,19.51 97.07,18.35 92.49,17.7
  Top 1.143: 92.49,17.7 Z.2
Z_CUR_REF
  Top 0.305: IC6.P$17 77.76,10.87 arc-45 76.74,8.42 73.36,5.04 arc-45 68.9,3.19 TP3.TP 66.61,3.19 arc-60 62.18,5.77 R39.2
Z_DIR  (via drill 0.36, 0.61)
  Top 0.305: IC6.P$19 78.76,12.65 arc-90 v79,12.51 | R49.1 53.91,25.97 | R49.1 53.47,26.47 arc-45 52.45,28.92 52.45,33.75 arc45 51.66,35.66 49.81,37.51 arc-45 49.28,38.79 49.28,42.79 arc45 49.22,42.92 49.22,42.92 arc45 49.03,43 IC5.73 | R49.1 53.94,25.39 arc90 54.88,24.45 58.75,24.45 arc-45 60.35,23.79 v63.88,20.26
  Bottom 0.305: v63.88,20.26 63.88,17.95 arc45 64.5,16.47 67.93,13.04 arc45 69.2,12.51 v79,12.51
Z_MS1  (via drill 0.61)
  Top 0.305: v38.8,37 40.36,38.57 arc45 40.8,39.61 IC5.86 | IC6.P$9 65.62,18 arc-45 59.79,20.42 58.78,21.42 arc45 54.23,23.31 54.07,23.15 arc45 53.88,22.67 R43.1 arc-50 52.86,22.34 v52.8,22.42
  Bottom 0.305: v38.8,37 arc45 41.5,35.88 49.05,35.88 arc-44 50.31,35.37 52.53,33.21 arc-46 52.8,32.59 v52.8,22.42
Z_MS2  (via drill 0.61)
  Top 0.305: v38.8,35 40.75,36.96 arc45 41.3,38.27 IC5.85 | IC6.P$10 59.23,17.5 arc-45 58.01,18 57.95,18.06 arc45 57.25,18.35 55.35,18.35 arc-45 54.09,18.88 53.98,18.99 53.98,19.96 R44.1 52.08,20 v51.94,20.13
  Bottom 0.305: v51.94,20.13 51.94,32.09 arc45 51.42,33.36 50.08,34.71 arc45 49.39,35 v38.8,35
Z_MS3  (via drill 0.61)
  Top 0.305: v38.8,33 41.12,35.33 arc45 41.8,36.95 IC5.84 | v51.94,17.59 52.54,17 R45.1 53.94,16.43 arc-45 54.13,16.9 arc-45 54.37,17 IC6.P$11
  Bottom 0.305: v38.8,33 42.76,33 arc45 43.55,33.33 43.95,33.73 arc-45 44.85,34.1 48.88,34.1 arc-45 49.78,33.73 50.3,33.2 arc-45 50.67,32.31 50.67,20.04 arc45 51.51,18.03 v51.94,17.59
Z_STEP  (via drill 0.61)
  Top 0.305: v54.48,30.29 arc45 53.94,28.97 R50.1 53.68,28.26 arc-45 53.09,29.68 53.09,33.74 arc45 52.11,36.09 50.78,37.43 arc-45 49.91,39.52 49.91,43.12 arc45 49.82,43.33 arc45 49.42,43.5 IC5.74 | IC6.P$16 77.26,12.98 arc-45 76.91,12.14 v75.63,10.86
  Bottom 0.305: v75.63,10.86 58.18,10.86 arc-45 56.86,11.41 55.01,13.26 arc-45 54.48,14.53 v54.48,30.29
ZL1
  Top 0.305: IC5.18 8.99,35.5 arc59 8.84,35.41 7.76,33.61 7.26,34.6 8.88,35.49 7.74,34.59 8.03,34.59 8.41,34.96 8.41,34.74 7.76,34.1 7.76,34.2 7.92,34.37 7.53,34.51 LIMITS.5 R52.1
ZL2  (via drill 0.61)
  Top 0.305: v33.8,28 34.14,28.34 arc45 34.3,28.72 IC5.27 | R48.1 LIMITS.6
  Bottom 0.305: 8.57,30.56 10.25,29.16 arc40 13.44,28 v33.8,28 | LIMITS.6 8.14,30.96 7.74,31.6 7.51,31.27 7.84,31.06 7.14,31.18 | 8.57,30.56 7.78,32 7.14,31.18 | 7.14,31.18 8.57,30.56

## Text on the board
tNames: [NSL] http://www.nullspacelabs.com | + | D+ | + | D- | X | usbvcc | 500mA | Y | RXD2 | XL1 | TXD2 | XL2 | YL1 | YL2 | 1 | ZL1 | ZL2 | Z | 1 | [NullSpaceLabs] http://www.032.la | charliex/mmca